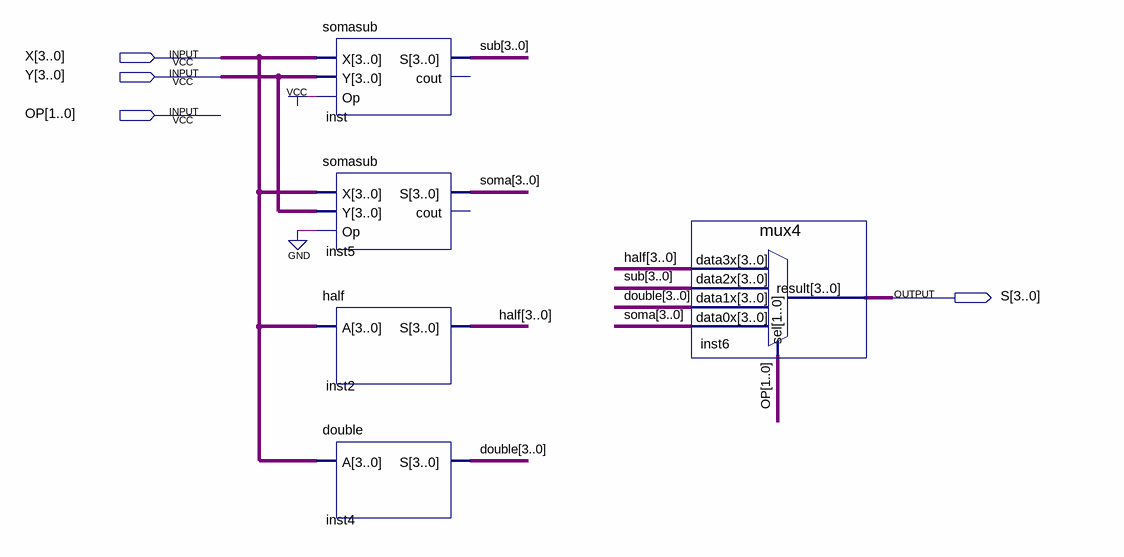
[diagram p0: schematic sheet]
// Quartus schematic ula.bdf as structural Verilog: 5 symbols, 4 pins
module ula (
  input  [3:0] X,
  input  [3:0] Y,
  input  [1:0] OP,
  output [3:0] S
);

  wire [3:0] double, half, soma, sub;

  somasub inst (.X(X), .Y(Y), .Op(1'b1), .S(sub));  // open: cout
  somasub inst5 (.X(X), .Y(Y), .Op(1'b0), .S(soma));  // open: cout
  half inst2 (.A(X), .S(half));
  double inst4 (.A(X), .S(double));
  mux4 inst6 (.data3x(half), .data2x(sub), .data1x(double), .data0x(soma), .sel(OP), .result(S));
endmodule
